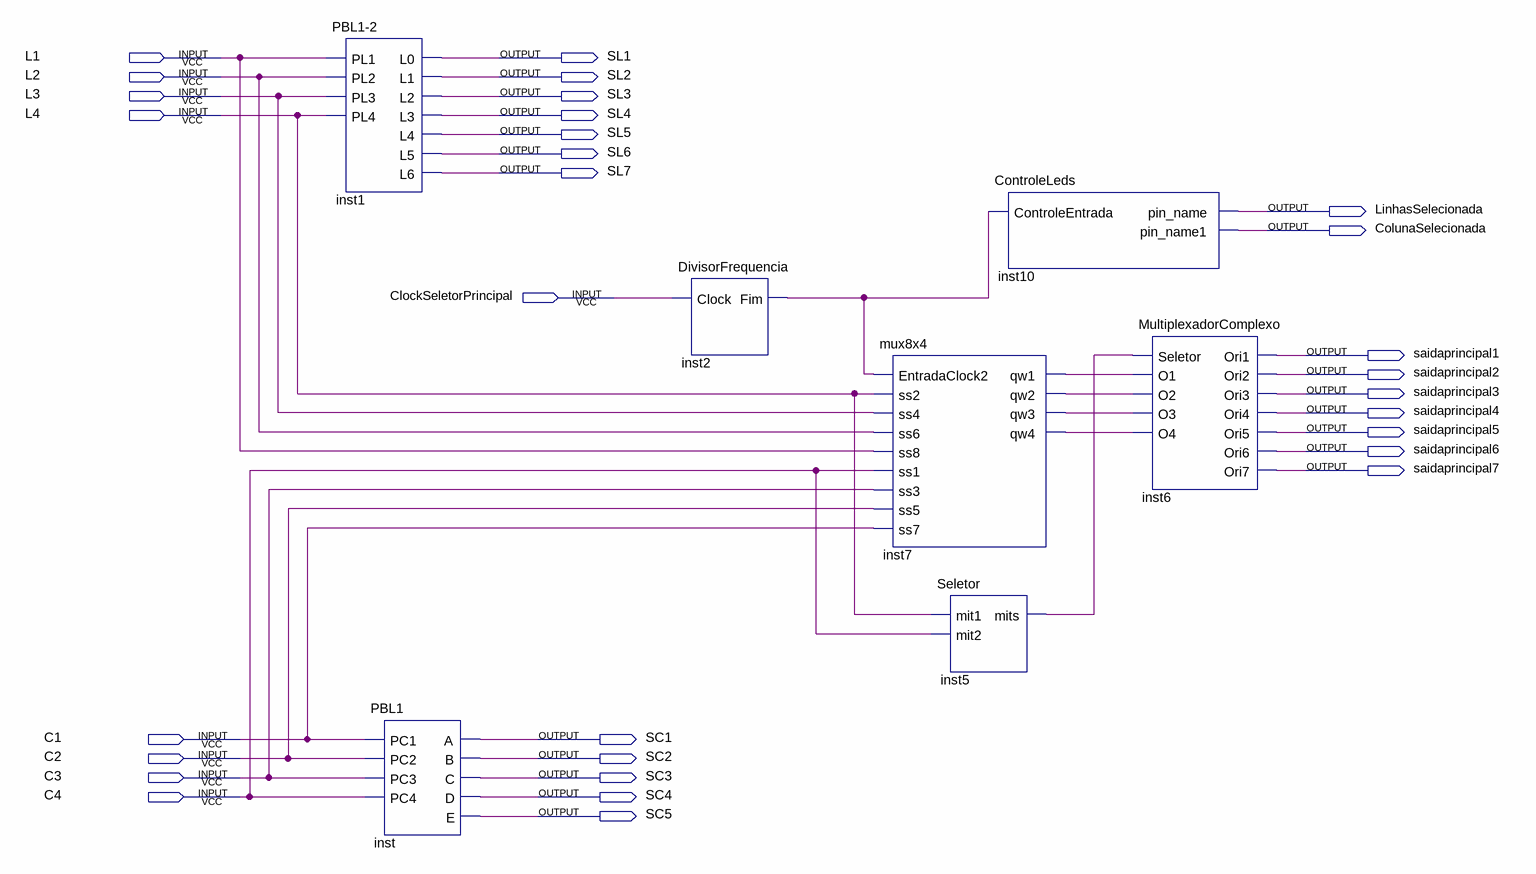
[diagram p0: schematic sheet]
// Quartus schematic CircuitoDigital.bdf as structural Verilog: 7 symbols, 30 pins
module CircuitoDigital (
  input  L1,
  input  L2,
  input  L3,
  input  L4,
  input  ClockSeletorPrincipal,
  input  C1,
  input  C2,
  input  C3,
  input  C4,
  output SL1,
  output SL2,
  output SL3,
  output SL4,
  output SL5,
  output SL6,
  output SL7,
  output LinhasSelecionada,
  output ColunaSelecionada,
  output saidaprincipal1,
  output saidaprincipal2,
  output saidaprincipal3,
  output saidaprincipal4,
  output saidaprincipal5,
  output saidaprincipal6,
  output saidaprincipal7,
  output SC1,
  output SC2,
  output SC3,
  output SC4,
  output SC5
);

  wire inst2_fim, inst5_mits, inst7_qw1, inst7_qw2, inst7_qw3, inst7_qw4;

  \PBL1-2  inst1 (
    .PL1(L1), .PL2(L2), .PL3(L3), .PL4(L4), .L0(SL1), .L1(SL2), .L2(SL3), .L3(SL4), .L4(SL5), .L5(SL6),
    .L6(SL7));
  PBL1 inst (.PC1(C1), .PC2(C2), .PC3(C3), .PC4(C4), .A(SC1), .B(SC2), .C(SC3), .D(SC4), .E(SC5));
  DivisorFrequencia inst2 (.Clock(ClockSeletorPrincipal), .Fim(inst2_fim));
  mux8x4 inst7 (
    .EntradaClock2(inst2_fim), .ss2(L4), .ss4(L3), .ss6(L2), .ss8(L1), .ss1(C4), .ss3(C3), .ss5(C2),
    .ss7(C1), .qw1(inst7_qw1), .qw2(inst7_qw2), .qw3(inst7_qw3), .qw4(inst7_qw4));
  Seletor inst5 (.mit1(L4), .mit2(C4), .mits(inst5_mits));
  ControleLeds inst10 (.ControleEntrada(inst2_fim), .pin_name(LinhasSelecionada), .pin_name1(ColunaSelecionada));
  MultiplexadorComplexo inst6 (
    .Seletor(inst5_mits), .O1(inst7_qw1), .O2(inst7_qw2), .O3(inst7_qw3), .O4(inst7_qw4),
    .Ori7(saidaprincipal7), .Ori1(saidaprincipal1), .Ori2(saidaprincipal2), .Ori3(saidaprincipal3),
    .Ori4(saidaprincipal4), .Ori5(saidaprincipal5), .Ori6(saidaprincipal6));
endmodule
